# EAGLE schematic ButtonsLEDs (EAGLE 7.4.0)
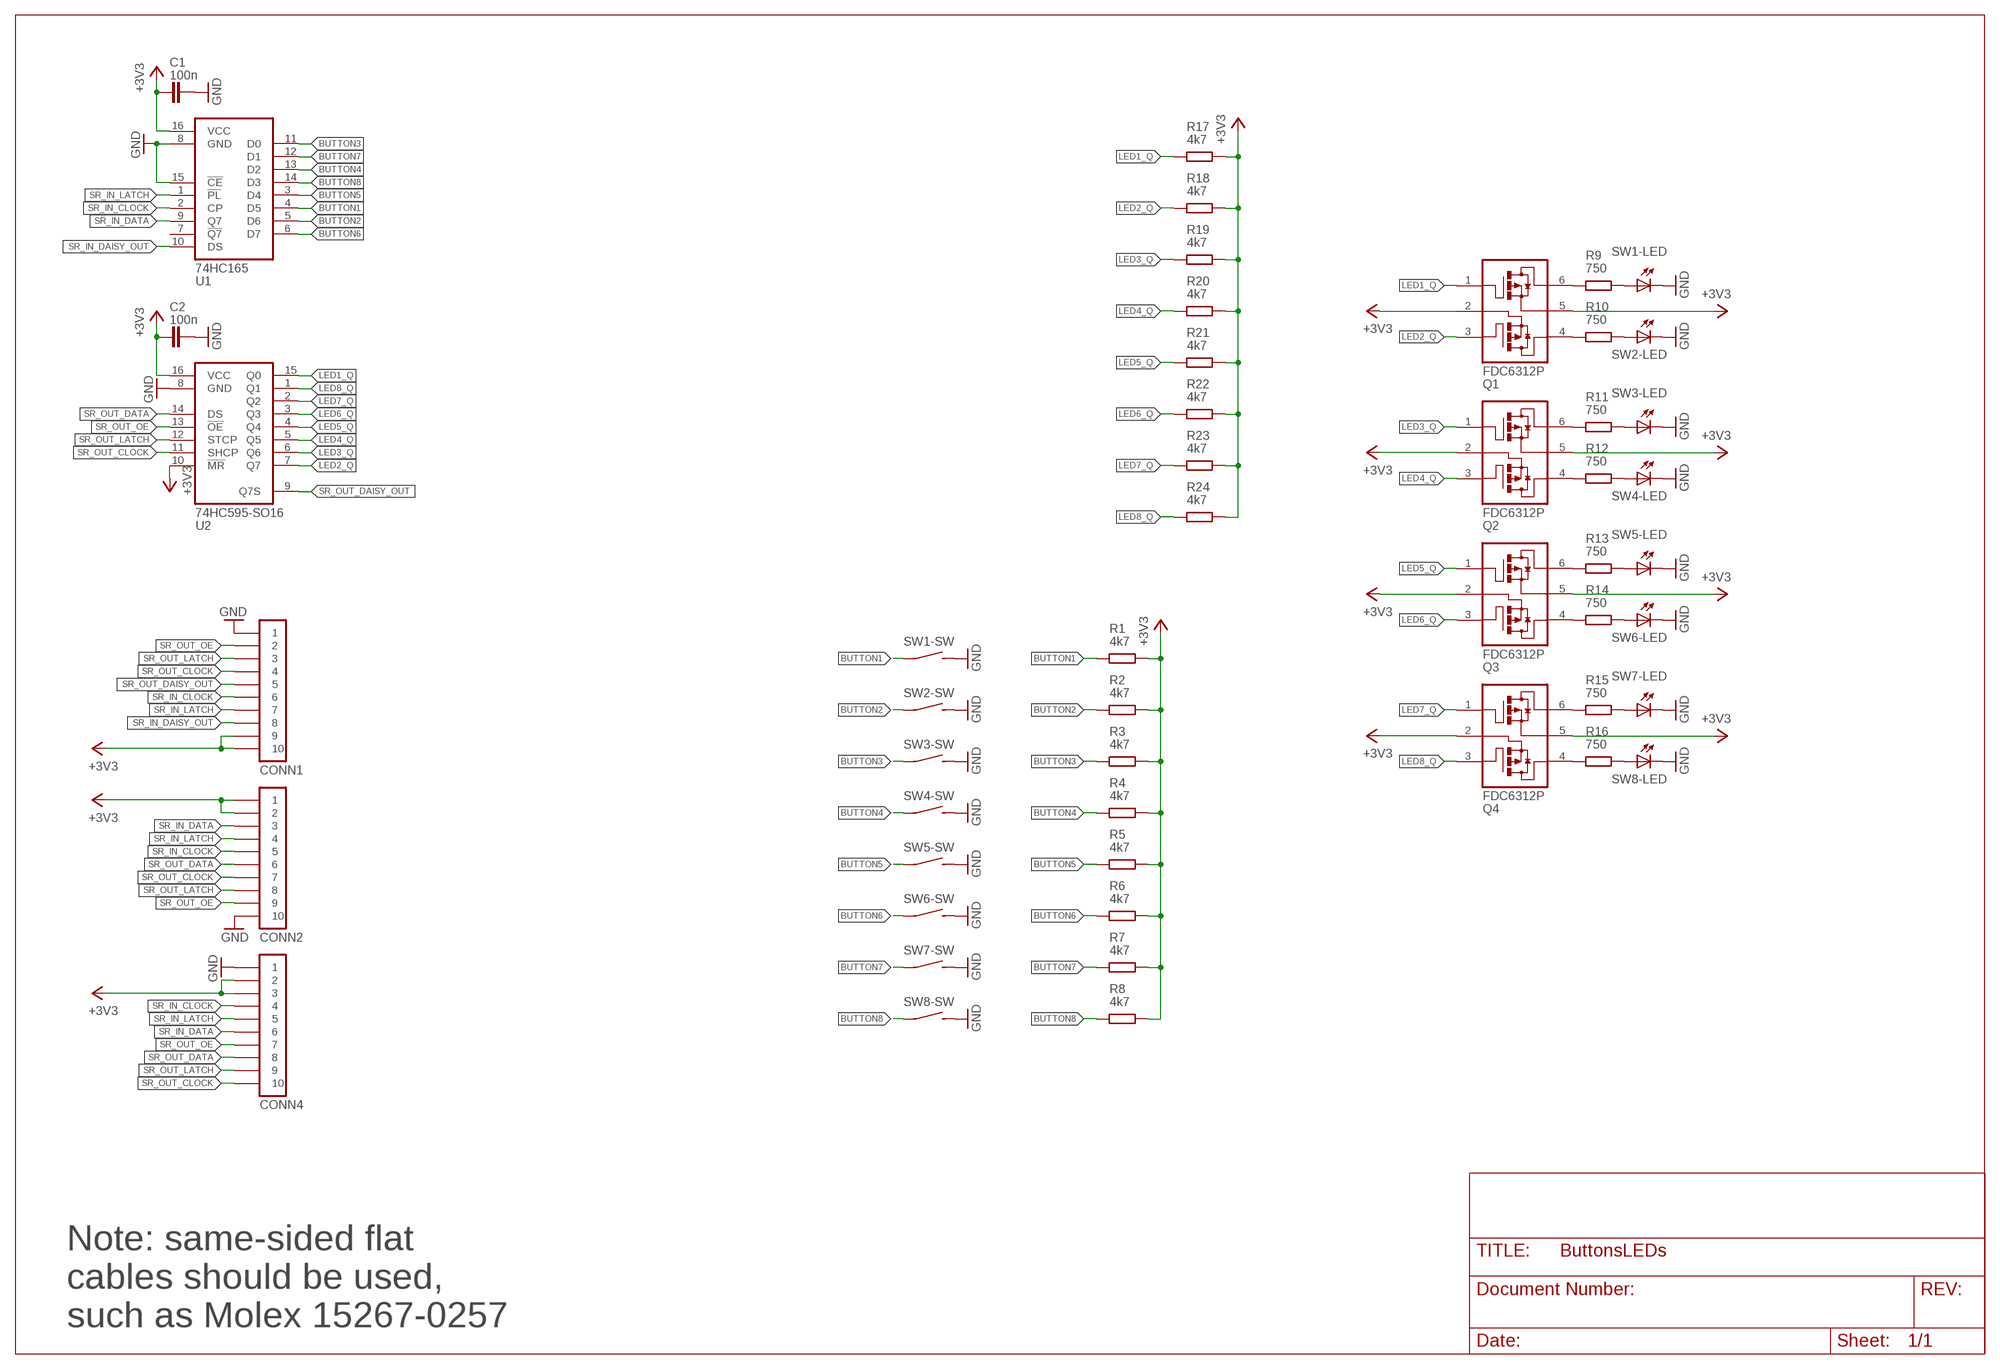
[diagram p0: schematic, sheet 1]

## Parts
C1  100n  CAPACITOR-0805  [C0805]
C2  100n  CAPACITOR-0805  [C0805]
CONN1  PINHD-1X10-FFC-1MM-Z  [MOLEX-52271-1079]
CONN2  PINHD-1X10-FFC-1MM-Z  [MOLEX-52271-1079]
CONN4  PINHD-1X10-FFC-1MM-Z  [MOLEX-52271-1079]
Q1  FDC6312P  [SSOT6]
Q2  FDC6312P  [SSOT6]
Q3  FDC6312P  [SSOT6]
Q4  FDC6312P  [SSOT6]
R1  4k7  RESISTOR-0805  [R0805]
R2  4k7  RESISTOR-0805  [R0805]
R3  4k7  RESISTOR-0805  [R0805]
R4  4k7  RESISTOR-0805  [R0805]
R5  4k7  RESISTOR-0805  [R0805]
R6  4k7  RESISTOR-0805  [R0805]
R7  4k7  RESISTOR-0805  [R0805]
R8  4k7  RESISTOR-0805  [R0805]
R9  750  RESISTOR-0805  [R0805]
R10  750  RESISTOR-0805  [R0805]
R11  750  RESISTOR-0805  [R0805]
R12  750  RESISTOR-0805  [R0805]
R13  750  RESISTOR-0805  [R0805]
R14  750  RESISTOR-0805  [R0805]
R15  750  RESISTOR-0805  [R0805]
R16  750  RESISTOR-0805  [R0805]
R17  4k7  RESISTOR-0805  [R0805]
R18  4k7  RESISTOR-0805  [R0805]
R19  4k7  RESISTOR-0805  [R0805]
R20  4k7  RESISTOR-0805  [R0805]
R21  4k7  RESISTOR-0805  [R0805]
R22  4k7  RESISTOR-0805  [R0805]
R23  4k7  RESISTOR-0805  [R0805]
R24  4k7  RESISTOR-0805  [R0805]
SW1  OMRON-B3W-9  [OMRON-B3W-9]
SW2  OMRON-B3W-9  [OMRON-B3W-9]
SW3  OMRON-B3W-9  [OMRON-B3W-9]
SW4  OMRON-B3W-9  [OMRON-B3W-9]
SW5  OMRON-B3W-9  [OMRON-B3W-9]
SW6  OMRON-B3W-9  [OMRON-B3W-9]
SW7  OMRON-B3W-9  [OMRON-B3W-9]
SW8  OMRON-B3W-9  [OMRON-B3W-9]
U1  74HC165  [SO16]
U2  74HC595-SO16  [SO16]

## Nets
+3V3: C1.1 C2.1 CONN1.9 CONN1.10 CONN2.1 CONN2.2 CONN4.2 CONN4.3 Q1.2(S2) Q1.5(S1) Q2.2(S2) Q2.5(S1) Q3.2(S2) Q3.5(S1) Q4.2(S2) Q4.5(S1) R1.2 R2.2 R3.2 R4.2 R5.2 R6.2 R7.2 R8.2 R17.2 R18.2 R19.2 R20.2 R21.2 R22.2 R23.2 R24.2 U1.16(VCC) U2.10(!MR) U2.16(VCC)
BUTTON1: R1.1 SW1.1 U1.4(D5)
BUTTON2: R2.1 SW2.1 U1.5(D6)
BUTTON3: R3.1 SW3.1 U1.11(D0)
BUTTON4: R4.1 SW4.1 U1.13(D2)
BUTTON5: R5.1 SW5.1 U1.3(D4)
BUTTON6: R6.1 SW6.1 U1.6(D7)
BUTTON7: R7.1 SW7.1 U1.12(D1)
BUTTON8: R8.1 SW8.1 U1.14(D3)
GND: C1.2 C2.2 CONN1.1 CONN2.10 CONN4.1 SW1.3 SW1.6-C(-LED:C) SW2.3 SW2.6-C(-LED:C) SW3.3 SW3.6-C(-LED:C) SW4.3 SW4.6-C(-LED:C) SW5.3 SW5.6-C(-LED:C) SW6.3 SW6.6-C(-LED:C) SW7.3 SW7.6-C(-LED:C) SW8.3 SW8.6-C(-LED:C) U1.8(GND) U1.15(!CE) U2.8(GND)
LED1_Q: Q1.1(G1) R17.1 U2.15(Q0)
LED2_Q: Q1.3(G2) R18.1 U2.7(Q7)
LED3_Q: Q2.1(G1) R19.1 U2.6(Q6)
LED4_Q: Q2.3(G2) R20.1 U2.5(Q5)
LED5_Q: Q3.1(G1) R21.1 U2.4(Q4)
LED6_Q: Q3.3(G2) R22.1 U2.3(Q3)
LED7_Q: Q4.1(G1) R23.1 U2.2(Q2)
LED8_Q: Q4.3(G2) R24.1 U2.1(Q1)
N$1: R9.2 SW1.6-A(-LED:A)
N$2: R10.2 SW2.6-A(-LED:A)
N$3: R11.2 SW3.6-A(-LED:A)
N$4: R12.2 SW4.6-A(-LED:A)
N$5: R13.2 SW5.6-A(-LED:A)
N$6: R15.2 SW7.6-A(-LED:A)
N$7: R16.2 SW8.6-A(-LED:A)
N$8: R14.2 SW6.6-A(-LED:A)
N$24: Q1.6(D1) R9.1
N$25: Q1.4(D2) R10.1
N$26: Q2.6(D1) R11.1
N$27: Q2.4(D2) R12.1
N$28: Q3.6(D1) R13.1
N$29: Q3.4(D2) R14.1
N$30: Q4.6(D1) R15.1
N$31: Q4.4(D2) R16.1
SR_IN_CLOCK: CONN1.6 CONN2.5 CONN4.4 U1.2(CP)
SR_IN_DAISY_OUT: CONN1.8 U1.10(DS)
SR_IN_DATA: CONN2.3 CONN4.6 U1.9(Q7)
SR_IN_LATCH: CONN1.7 CONN2.4 CONN4.5 U1.1(!PL)
SR_OUT_CLOCK: CONN1.4 CONN2.7 CONN4.10 U2.11(SHCP)
SR_OUT_DAISY_OUT: CONN1.5 U2.9(Q7S)
SR_OUT_DATA: CONN2.6 CONN4.8 U2.14(DS)
SR_OUT_LATCH: CONN1.3 CONN2.8 CONN4.9 U2.12(STCP)
SR_OUT_OE: CONN1.2 CONN2.9 CONN4.7 U2.13(!OE)
Unconnected: U1.7(!Q7)

## Notes on the sheet
- Note: same-sided flat
  cables should be used,
  such as Molex 15267-0257

## Library data of the parts
C1 C2 = igor_lbr:CAPACITOR: Capacitor
CONN1 CONN2 CONN4 = igor_lbr:PINHD-1X10: Pin header; MANUFACTURER: Molex; MPN: 52271-1079
Q1-Q4 = igor_lbr:FDC6312P: Dual P-channel 1.8V PowerTrench Specified MOSFET; MANUFACTURER: ON Semiconductor; MPN: FDC6312P
R1-R24 = igor_lbr:RESISTOR: Resistor
SW1-SW8 = igor_lbr:OMRON-B3W-9: Illuminated Tactile Switch
U1 = igor_lbr:74*165: 8-bit parallel-in/serial out shift register; MANUFACTURER: Nexperia; MPN: 74HC165D
U2 = igor_lbr:74*595: 8-bit serial-in, parallel-out shift register; MANUFACTURER: Nexperia; MPN: 74HC595D